# EAGLE schematic ledboard-r2 (EAGLE 6.1)
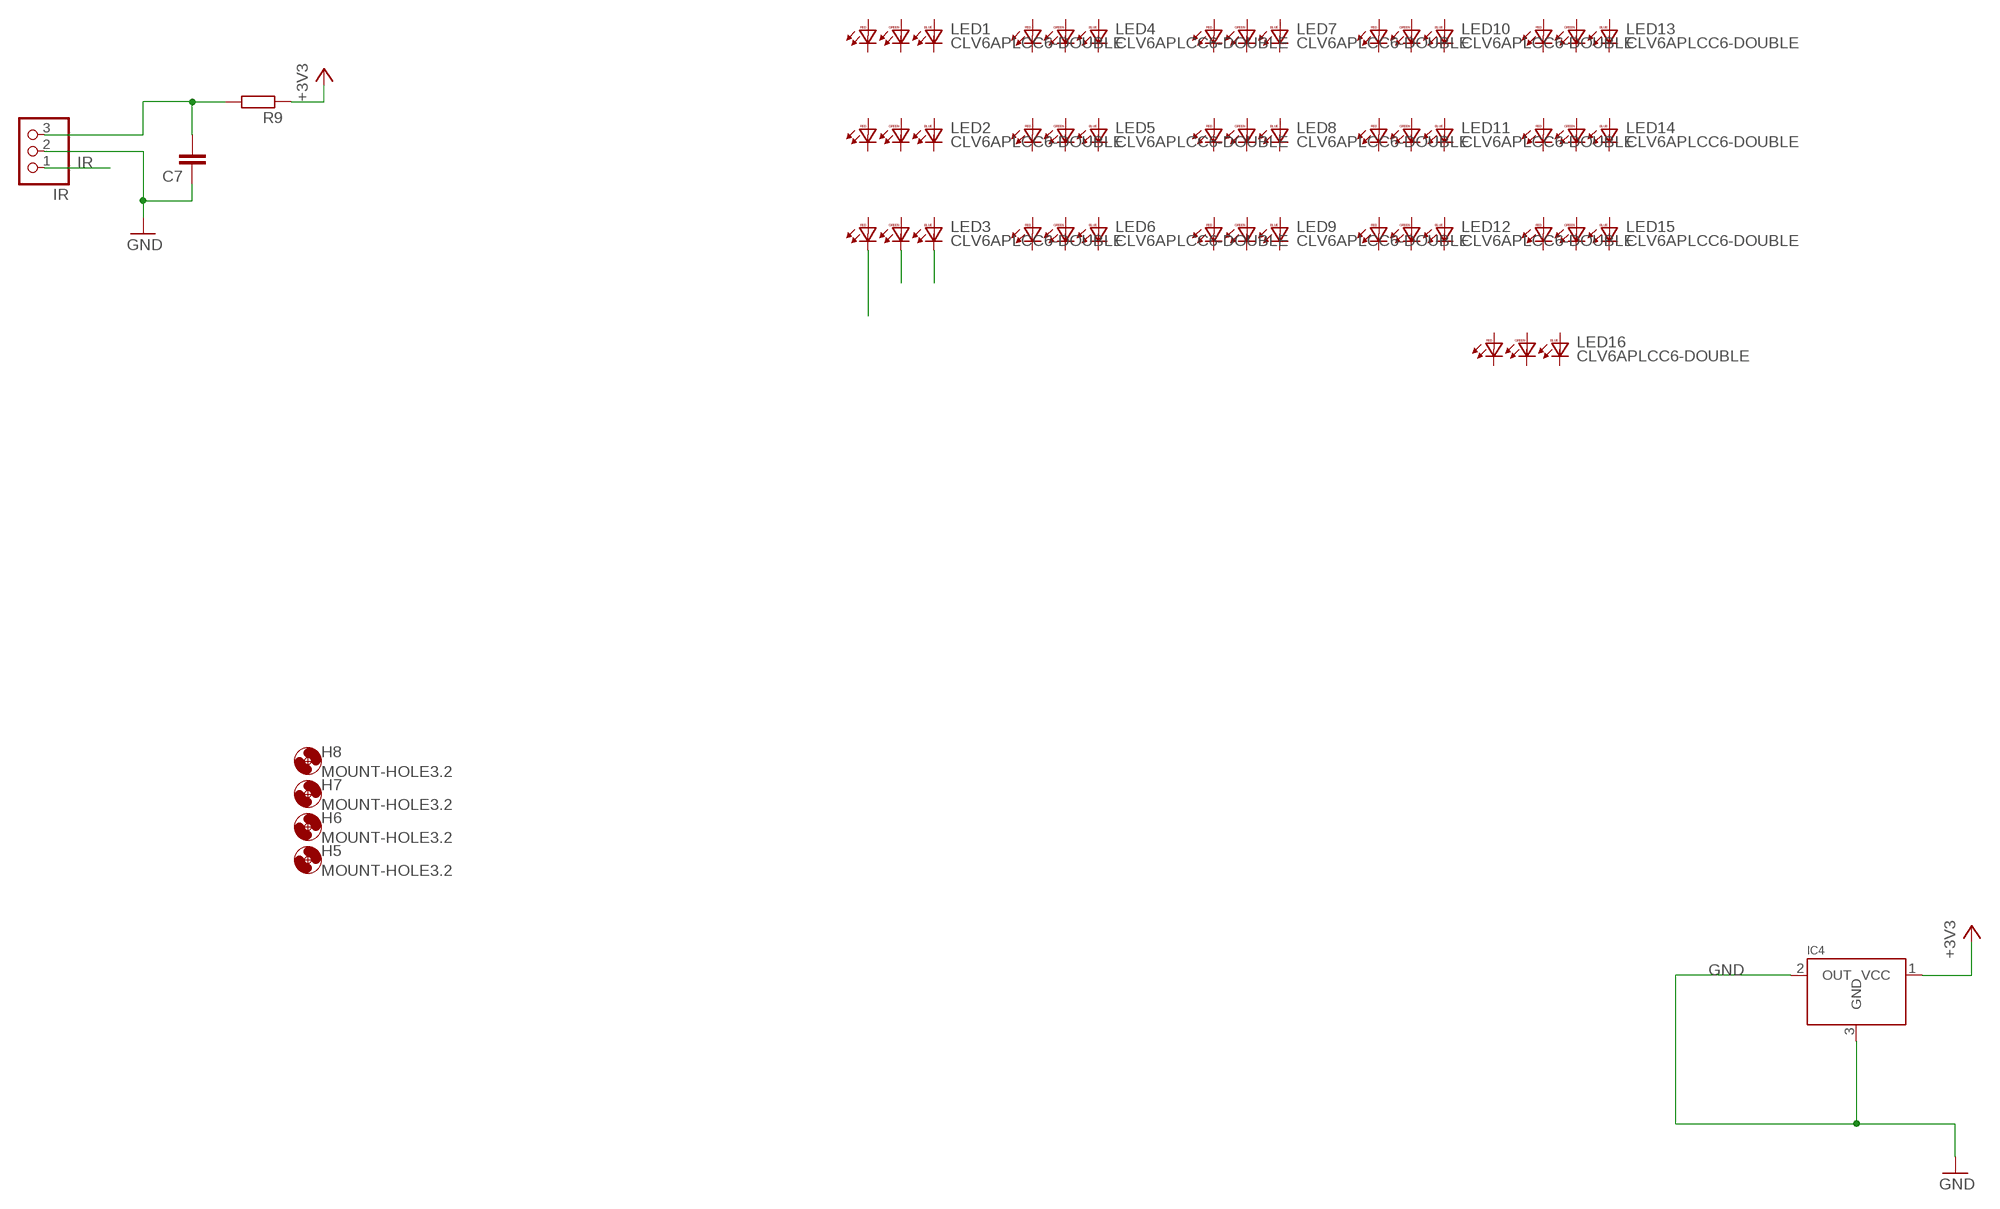
[diagram p0: schematic, sheet 1]

## Parts
C7  C-EUC0805  [C0805]
H5  MOUNT-HOLE3.2  [3,2]
H6  MOUNT-HOLE3.2  [3,2]
H7  MOUNT-HOLE3.2  [3,2]
H8  MOUNT-HOLE3.2  [3,2]
IC4  MCP9701T-E/TTCTREFLOW  [SOT23-R]
IR  PINHD-1X3  [1X03]
LED1  CLV6APLCC6-DOUBLE  [PLCC6-DOUBLE]
LED2  CLV6APLCC6-DOUBLE  [PLCC6-DOUBLE]
LED3  CLV6APLCC6-DOUBLE  [PLCC6-DOUBLE]
LED4  CLV6APLCC6-DOUBLE  [PLCC6-DOUBLE]
LED5  CLV6APLCC6-DOUBLE  [PLCC6-DOUBLE]
LED6  CLV6APLCC6-DOUBLE  [PLCC6-DOUBLE]
LED7  CLV6APLCC6-DOUBLE  [PLCC6-DOUBLE]
LED8  CLV6APLCC6-DOUBLE  [PLCC6-DOUBLE]
LED9  CLV6APLCC6-DOUBLE  [PLCC6-DOUBLE]
LED10  CLV6APLCC6-DOUBLE  [PLCC6-DOUBLE]
LED11  CLV6APLCC6-DOUBLE  [PLCC6-DOUBLE]
LED12  CLV6APLCC6-DOUBLE  [PLCC6-DOUBLE]
LED13  CLV6APLCC6-DOUBLE  [PLCC6-DOUBLE]
LED14  CLV6APLCC6-DOUBLE  [PLCC6-DOUBLE]
LED15  CLV6APLCC6-DOUBLE  [PLCC6-DOUBLE]
LED16  CLV6APLCC6-DOUBLE  [PLCC6-DOUBLE]
R9  R-EU_R0805  [R0805]

## Nets
+3V3: IC4.1(VCC) R9.1
GND: C7.1 IC4.2(OUT) IC4.3(GND) IR.2
IR: IR.1
N$1: LED3.3(RC)
N$2: LED3.2(GC)
N$3: LED3.1(BC)
N$65: C7.2 IR.3 R9.2
Unconnected: LED1.1(BC) LED1.2(GC) LED1.3(RC) LED1.4(RA) LED1.5(GA) LED1.6(BA) LED2.1(BC) LED2.2(GC) LED2.3(RC) LED2.4(RA) LED2.5(GA) LED2.6(BA) LED3.4(RA) LED3.5(GA) LED3.6(BA) LED4.1(BC) LED4.2(GC) LED4.3(RC) LED4.4(RA) LED4.5(GA) LED4.6(BA) LED5.1(BC) LED5.2(GC) LED5.3(RC) LED5.4(RA) LED5.5(GA) LED5.6(BA) LED6.1(BC) LED6.2(GC) LED6.3(RC) LED6.4(RA) LED6.5(GA) LED6.6(BA) LED7.1(BC) LED7.2(GC) LED7.3(RC) LED7.4(RA) LED7.5(GA) LED7.6(BA) LED8.1(BC) LED8.2(GC) LED8.3(RC) LED8.4(RA) LED8.5(GA) LED8.6(BA) LED9.1(BC) LED9.2(GC) LED9.3(RC) LED9.4(RA) LED9.5(GA) LED9.6(BA) LED10.1(BC) LED10.2(GC) LED10.3(RC) LED10.4(RA) LED10.5(GA) LED10.6(BA) LED11.1(BC) LED11.2(GC) LED11.3(RC) LED11.4(RA) LED11.5(GA) LED11.6(BA) LED12.1(BC) LED12.2(GC) LED12.3(RC) LED12.4(RA) LED12.5(GA) LED12.6(BA) LED13.1(BC) LED13.2(GC) LED13.3(RC) LED13.4(RA) LED13.5(GA) LED13.6(BA) LED14.1(BC) LED14.2(GC) LED14.3(RC) LED14.4(RA) LED14.5(GA) LED14.6(BA) LED15.1(BC) LED15.2(GC) LED15.3(RC) LED15.4(RA) LED15.5(GA) LED15.6(BA) LED16.1(BC) LED16.2(GC) LED16.3(RC) LED16.4(RA) LED16.5(GA) LED16.6(BA)

## Library data of the parts
C7 = rcl:C-EU: CAPACITOR, European symbol
H5-H8 = holes:MOUNT-HOLE: MOUNTING HOLE with drill center marker
IC4 = xtort:MCP9701T-E/TTCT
IR = pinhead:PINHD-1X3: PIN HEADER
LED1-LED16 = xtort:CLV6A: Full color RGB LED CLV6A Source: http://www.cree.com/products/pdf/ledlamps/clv6a-fkb.pdf
R9 = rcl:R-EU_: RESISTOR, European symbol